# EAGLE design ciot (EAGLE 6.6.0)

## Sheet 1 of 2
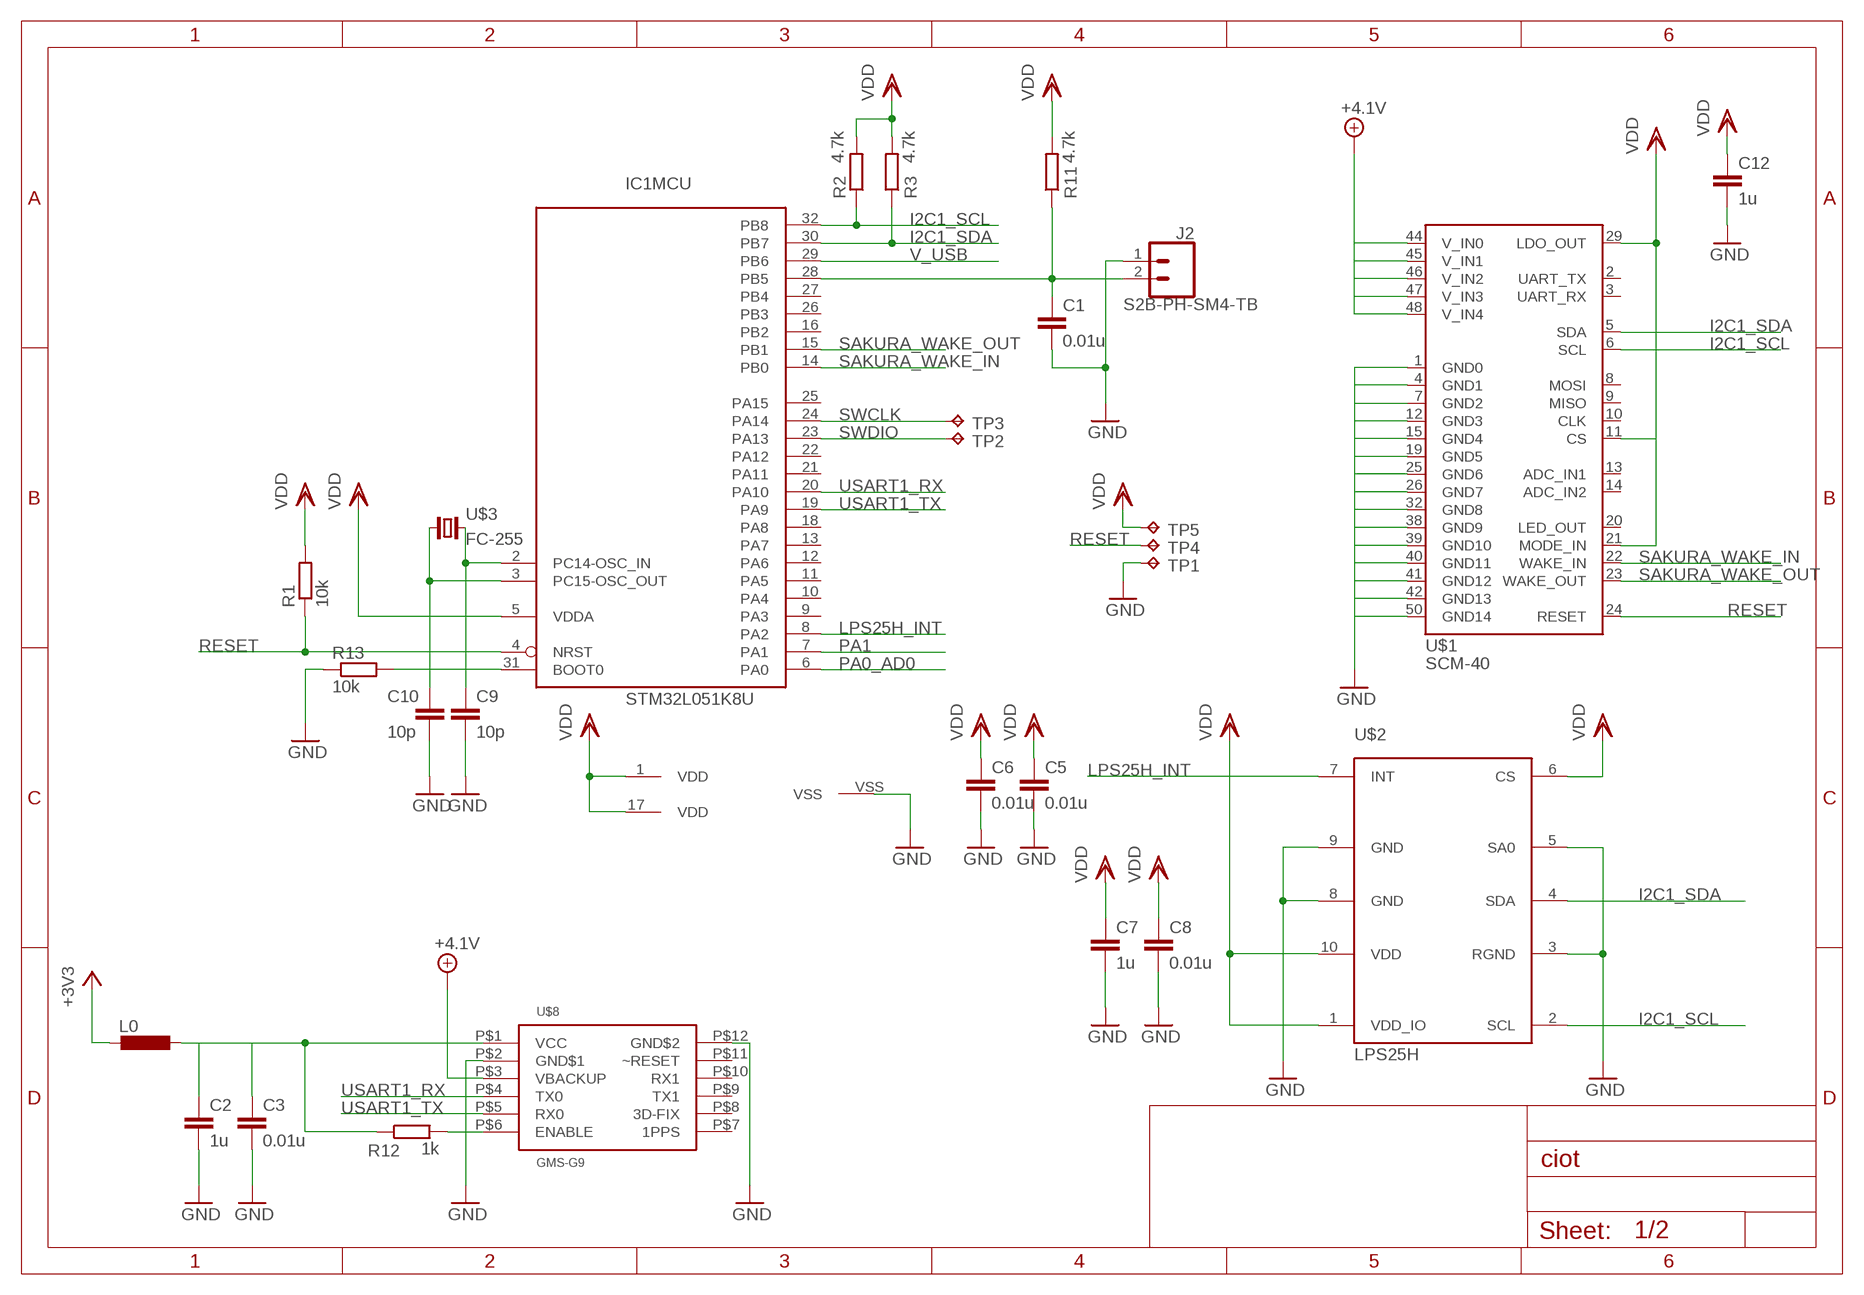
[diagram p0: schematic, sheet 1]

### Parts
C1  0.01u  C-EUC0603K  [C0603K]
C2  1u  C-EUC0603K  [C0603K]
C3  0.01u  C-EUC0603K  [C0603K]
C5  0.01u  C-EUC0603K  [C0603K]
C6  0.01u  C-EUC0603K  [C0603K]
C7  1u  C-EUC0603K  [C0603K]
C8  0.01u  C-EUC0603K  [C0603K]
C9  10p  C-EUC0603K  [C0603K]
C10  10p  C-EUC0603K  [C0603K]
C12  1u  C-EUC0603K  [C0603K]
IC1  STM32L051K8U  [UFQFPN32]
J2  S2B-PH-SM4-TB  CONN_02-JST-2MM-SMT  [JST-2-SMD]
L0  L-EUL2012C  [L2012C]
R1  10k  R-EU_R0603  [R0603]
R2  4.7k  R-EU_R0603  [R0603]
R3  4.7k  R-EU_R0603  [R0603]
R11  4.7k  R-EU_R0603  [R0603]
R12  1k  R-EU_R0603  [R0603]
R13  10k  R-EU_R0603  [R0603]
TP1  TPB1,27  [B1,27]
TP2  TPB1,27  [B1,27]
TP3  TPB1,27  [B1,27]
TP4  TPB1,27  [B1,27]
TP5  TPB1,27  [B1,27]
U$1  SCM-40  [SCM-DF40-50DS]
U$2  LPS25H  [LPS25H]
U$3  FC-255  [FC-255]
U$8  GMS-G9  [GMS-G9]

### Nets
+3V3: L0.2 ; also sheet 2
+4.1V: U$1.44(V_IN0) U$1.45(V_IN1) U$1.46(V_IN2) U$1.47(V_IN3) U$1.48(V_IN4) U$8.P$3(VBACKUP) ; also sheet 2
GND: C1.2 C2.2 C3.2 C5.2 C6.2 C7.2 C8.2 C9.2 C10.2 C12.2 IC1.VSS(PWR:VSS) J2.1 R13.1 TP1.TP U$1.1(GND0) U$1.4(GND1) U$1.7(GND2) U$1.12(GND3) U$1.15(GND4) U$1.19(GND5) U$1.25(GND6) U$1.26(GND7) U$1.32(GND8) U$1.38(GND9) U$1.39(GND10) U$1.40(GND11) U$1.41(GND12) U$1.42(GND13) U$1.50(GND14) U$2.3(RGND) U$2.5(SA0) U$2.8(GND) U$2.9(GND) U$8.P$2(GND$1) U$8.P$12(GND$2) ; also sheet 2
I2C1_SCL: IC1.32(MCU:PB8) R2.1 U$1.6(SCL) U$2.2(SCL)
I2C1_SDA: IC1.30(MCU:PB7) R3.1 U$1.5(SDA) U$2.4(SDA)
LPS25H_INT: IC1.8(MCU:PA2) U$2.7(INT)
N$1: IC1.31(MCU:BOOT0) R13.2
N$2: C2.1 C3.1 L0.1 R12.1 U$8.P$1(VCC)
N$3: C1.1 IC1.28(MCU:PB5) J2.2 R11.1
N$4: C10.1 IC1.3(MCU:PC15-OSC_OUT) U$3.1
N$5: C9.1 IC1.2(MCU:PC14-OSC_IN) U$3.2
N$25: R12.2 U$8.P$6(ENABLE)
PA0_AD0: IC1.6(MCU:PA0) ; also sheet 2
PA1: IC1.7(MCU:PA1) ; also sheet 2
RESET: IC1.4(MCU:NRST) R1.1 TP4.TP U$1.24(RESET)
SAKURA_WAKE_IN: IC1.14(MCU:PB0) U$1.22(WAKE_IN)
SAKURA_WAKE_OUT: IC1.15(MCU:PB1) U$1.23(WAKE_OUT)
SWCLK: IC1.24(MCU:PA14) TP3.TP
SWDIO: IC1.23(MCU:PA13) TP2.TP
USART1_RX: IC1.20(MCU:PA10) U$8.P$4(TX0)
USART1_TX: IC1.19(MCU:PA9) U$8.P$5(RX0)
V_USB: IC1.29(MCU:PB6) ; also sheet 2
VDD: C5.1 C6.1 C7.1 C8.1 C12.1 IC1.1(PWR:VDD) IC1.5(MCU:VDDA) IC1.17(PWR:VDD) R1.2 R2.2 R3.2 R11.2 TP5.TP U$1.11(CS) U$1.21(MODE_IN) U$1.29(LDO_OUT) U$2.1(VDD_IO) U$2.6(CS) U$2.10(VDD)
Unconnected: IC1.9(MCU:PA3) IC1.10(MCU:PA4) IC1.11(MCU:PA5) IC1.12(MCU:PA6) IC1.13(MCU:PA7) IC1.16(MCU:PB2) IC1.18(MCU:PA8) IC1.21(MCU:PA11) IC1.22(MCU:PA12) IC1.25(MCU:PA15) IC1.26(MCU:PB3) IC1.27(MCU:PB4) U$1.2(UART_TX) U$1.3(UART_RX) U$1.8(MOSI) U$1.9(MISO) U$1.10(CLK) U$1.13(ADC_IN1) U$1.14(ADC_IN2) U$1.20(LED_OUT) U$8.P$7(1PPS) U$8.P$8(3D-FIX) U$8.P$9(TX1) U$8.P$10(RX1) U$8.P$11(~RESET)

### Notes on the sheet
- LPS25H

## Sheet 2 of 2
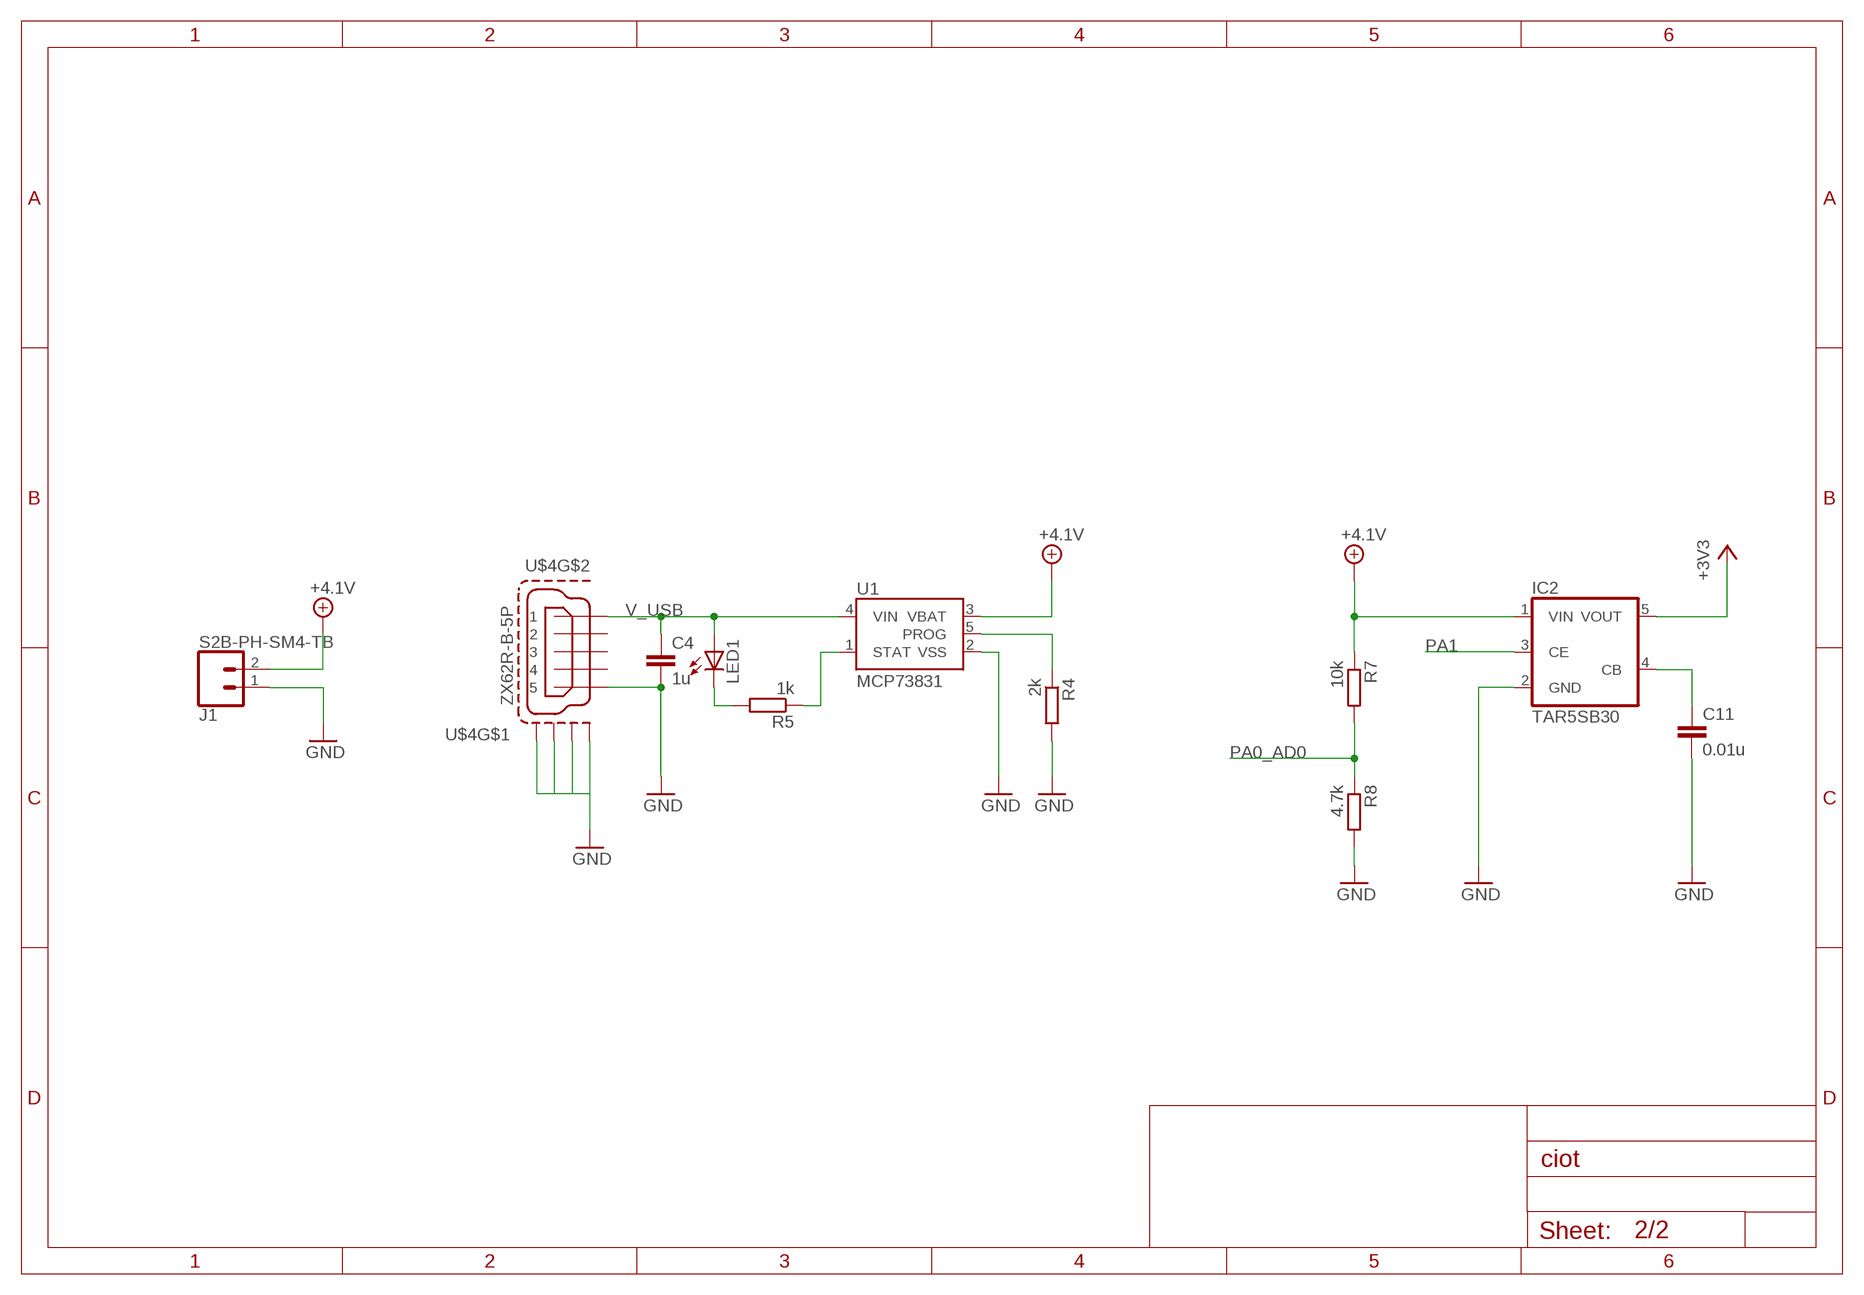
[diagram p1: schematic, sheet 2]

### Parts
C4  1u  C-EUC0603K  [C0603K]
C11  0.01u  C-EUC0603K  [C0603K]
IC2  TAR5SB30  TS520530  [SOT25]
J1  S2B-PH-SM4-TB  CONN_02-JST-2MM-SMT  [JST-2-SMD]
LED1  LEDCHIPLED_0603  [CHIPLED_0603]
R4  2k  R-EU_R0603  [R0603]
R5  1k  R-EU_R0603  [R0603]
R7  10k  R-EU_R0603  [R0603]
R8  4.7k  R-EU_R0603  [R0603]
U1  MCP73831  [SOT23-5]
U$4  ZX62R-B-5P  MICRO-USB-SHIELD-ZX62R-B-5P  [ZX62R-B-5P]

### Nets
+3V3: IC2.5(VOUT) ; also sheet 1
+4.1V: IC2.1(VIN) J1.2 R7.1 U1.3(VBAT) ; also sheet 1
GND: C4.2 C11.2 IC2.2(GND) J1.1 R4.2 R8.2 U1.2(VSS) U$4.5 U$4.M1(S1) U$4.M2(S2) U$4.M3(S3) U$4.M4(S4) ; also sheet 1
N$6: C11.1 IC2.4(CB)
N$8: LED1.C R5.2
N$9: R5.1 U1.1(STAT)
N$10: R4.1 U1.5(PROG)
PA0_AD0: R7.2 R8.1 ; also sheet 1
PA1: IC2.3(CE) ; also sheet 1
V_USB: C4.1 LED1.A U1.4(VIN) U$4.1 ; also sheet 1
Unconnected: U$4.2 U$4.3 U$4.4

## Library data of the parts
C1-C12 = resistor:C-EU: CAPACITOR, European symbol
IC1 = micro-stm_v3:STM32L051K*U: ARM 32-bit Cortex™-M0+ CPU 32 MHz maximum frequency 32 to 64 Kbytes of Flash memory 2 kbyte of Data EEPROM 8 kbytes of SRAM 27 GPIOs 1.8 to 3.6 V application supply
IC2 = v-reg:TS5205: 150mA Low Noise LDO Voltage Regulator with Enable TSC [Taiwan Semiconductor Company, Ltd] Source: http://www.taiwansemi.com .. 5205_0409c.pdf
J1 J2 = SparkFun-Connectors:CONN_02: Multi connection point. Often used as Generic Header-pin footprint for 0.1 inch spaced/style header connections On any of the 0.1 inch spaced packages, you can populate with these: Break Away Headers - Straight <https://www.sparkfun.com/products/116> (PRT-00116) Break Away Male Headers - Right Angle <https://www.sparkfun.com/products/553> (PRT-00553) Female Headers <https://www.sparkfun.com/products/115> (PRT-00115) Break Away Headers - Machine Pin <https://www.sparkfun.com/products/117> (PRT-00117) Break Away Female Headers - Swiss Machine Pin <https://www.sparkfun.com/products/743> (PRT-00743) For SCREWTERMINALS and SPRING TERMINALS visit here: Screw Terimnals on SparkFun.com <https://www.sparkfun.com/search/results?term=Screw+Terminals> (5mm/3.5mm/2.54mm spacing) This device is also useful as a general connection point to wire up your design to another part of your project. Our various solder wires solder well into these plated through hole pads. Hook-Up Wire - Assortment (Stranded, 22 AWG) <https://www.sparkfun.com/products/11375> (PRT-11375) Hook-Up Wire - Assortment (Solid Core, 22 AWG) <https://www.sparkfun.com/products/11367> (PRT-11367) View the entire wire category on our website here <https://www.sparkfun.com/categories/141> Special notes: Molex polarized connector foot print use with: PRT-08233 with associated crimp pins and housings. 2.54_SCREWTERM for use with PRT-10571. 3.5mm Screw Terminal footprints for PRT-08084 5mm Screw Terminal footprints for use with PRT-08432; PROD_ID: CONN-11443
L0 = resistor:L-EU: INDUCTOR, European symbol
LED1 = led:LED: LED OSRAM: - CHIPLED LG R971, LG N971, LY N971, LG Q971, LY Q971, LO R971, LY R971 LH N974, LH R974 LS Q976, LO Q976, LY Q976 LO Q996 - Hyper CHIPLED LW Q18S LB Q993, LB Q99A, LB R99A - SideLED LS A670, LO A670, LY A670, LG A670, LP A670 LB A673, LV A673, LT A673, LW A673 LH A674 LY A675 LS A676, LA A676, LO A676, LY A676, LW A676 LS A679, LY A679, LG A679 - Hyper Micro SIDELED® LS Y876, LA Y876, LO Y876, LY Y876 LT Y87S - SmartLED LW L88C, LW L88S LB L89C, LB L89S, LG L890 LS L89K, LO L89K, LY L89K LS L896, LA L896, LO L896, LY L896 - TOPLED LS T670, LO T670, LY T670, LG T670, LP T670 LSG T670, LSP T670, LSY T670, LOP T670, LYG T670 LG T671, LOG T671, LSG T671 LB T673, LV T673, LT T673, LW T673 LH T674 LS T676, LA T676, LO T676, LY T676, LB T676, LH T676, LSB T676, LW T676 LB T67C, LV T67C, LT T67C, LS T67K, LO T67K, LY T67K, LW E67C LS E67B, LA E67B, LO E67B, LY E67B, LB E67C, LV E67C, LT E67C LW T67C LS T679, LY T679, LG T679 LS T770, LO T770, LY T770, LG T770, LP T770 LB T773, LV T773, LT T773, LW T773 LH T774 LS E675, LA E675, LY E675, LS T675 LS T776, LA T776, LO T776, LY T776, LB T776 LHGB T686 LT T68C, LB T68C - Hyper Mini TOPLED® LB M676 - Mini TOPLED Santana® LG M470 LS M47K, LO M47K, LY M47K Source: http://www.osram.convergy.de LUXEON: - LUMILED® LXK2-PW12-R00, LXK2-PW12-S00, LXK2-PW14-U00, LXK2-PW14-V00 LXK2-PM12-R00, LXK2-PM12-S00, LXK2-PM14-U00 LXK2-PE12-Q00, LXK2-PE12-R00, LXK2-PE12-S00, LXK2-PE14-T00, LXK2-PE14-U00 LXK2-PB12-K00, LXK2-PB12-L00, LXK2-PB12-M00, LXK2-PB14-N00, LXK2-PB14-P00, LXK2-PB14-Q00 LXK2-PR12-L00, LXK2-PR12-M00, LXK2-PR14-Q00, LXK2-PR14-R00 LXK2-PD12-Q00, LXK2-PD12-R00, LXK2-PD12-S00 LXK2-PH12-R00, LXK2-PH12-S00 LXK2-PL12-P00, LXK2-PL12-Q00, LXK2-PL12-R00 Source: www.luxeon.com KINGBRIGHT: KA-3528ASYC Source: www.kingbright.com
R1-R5 R7 R8 R11-R13 = resistor:R-EU_: RESISTOR, European symbol
TP1-TP5 = testpad:TP: Test pad
U1 = SparkFun-PowerIC:MCP73831: Miniature single cell, fully integrated Li-Ion, Li-polymer charge management controller http://ww1.microchip.com/downloads/en/DeviceDoc/21984a.pdf IC-09995; PROD_ID: IC-09995
U$1 = sakuraio:SCM-40
U$2 = chips:LPS25H: ST-Micro Piezoresistive pressure sensor; DIGIKEY: 497-15070-1-ND
U$3 = crystal:FC-255
U$4 = con-hirose:MICRO-USB-SHIELD-: Hirose Micro USB Connector ZX62R-B-5P: Micro B, reverse (top mount) shell SMT Supplier: DigiKey H11574CT-ND Source: http://www.hirose.co.jp/cataloge_hp/e24200011.pdf
U$8 = gms-g9:GMS-G9

## Board
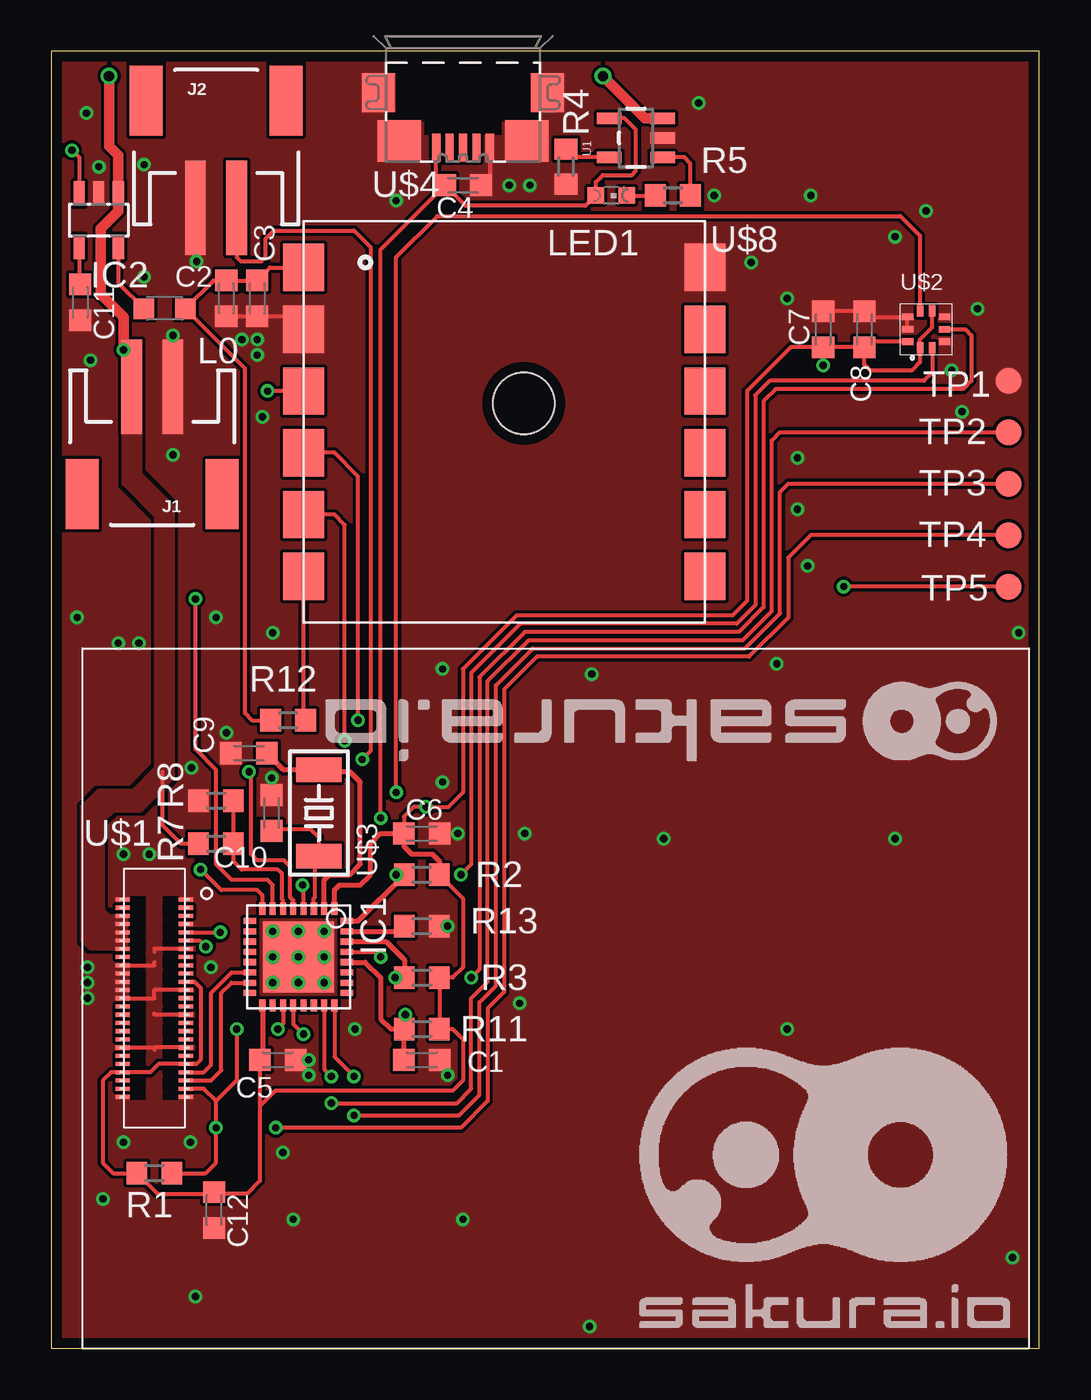
[diagram p2: board, top side]
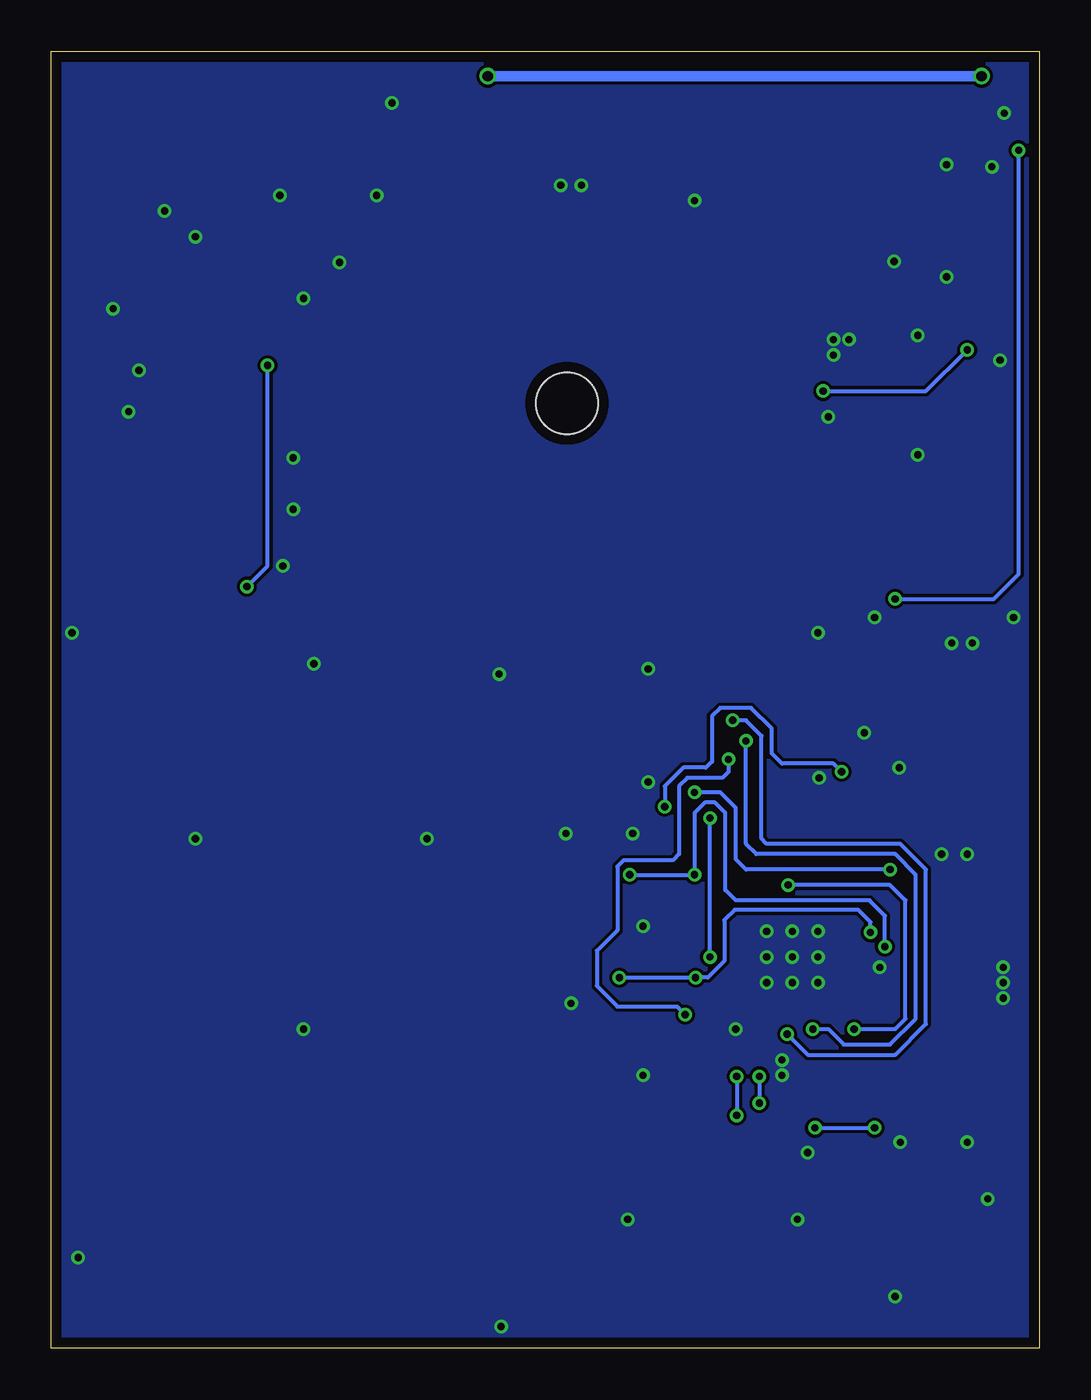
[diagram p3: board, bottom side, seen from below]

Size 48 x 63 mm. Coordinates in mm from the lower left corner, seen from the top.
Outline: 0,0 48,0 48,63 0,63 0,0
Copper layers (1*16): Top 0.035mm / dielectric 1.6mm / Bottom 0.035mm
Design rules "Elecrow_2-layer_PCB_eagle_rule": minimum track width 6mil, minimum drill 12mil, track to track 6mil, track to pad 6mil, pad to pad 6mil, via to via 8mil, smd to smd 0mil, copper to edge 20mil, drill to drill 10mil, minimum pad ring 6mil, minimum via ring 6mil, stop-mask expansion 0mil, vias tented up to drill 100mil, thermal gap 10mil

### Footprints (pad centres in the part's own frame; a part is rotated, then mirrored left to right if it is on the bottom)
C0603K = smd 1.05 x 1.08: 1 -0.875,0; 2 0.875,0
UFQFPN32 = smd 0.6 x 0.3: 1 -2.35,1.75; 2 -2.35,1.25; 3 -2.35,0.75; 4 -2.35,0.25; 5 -2.35,-0.25; 6 -2.35,-0.75; 7 -2.35,-1.25; 8 -2.35,-1.75; 17 2.35,-1.75; 18 2.35,-1.25; 19 2.35,-0.75; 20 2.35,-0.25; 21 2.35,0.25; 22 2.35,0.75; 23 2.35,1.25; 24 2.35,1.75 | smd 0.3 x 0.6: 9 -1.75,-2.35; 10 -1.25,-2.35; 11 -0.75,-2.35; 12 -0.25,-2.35; 13 0.25,-2.35; 14 0.75,-2.35; 15 1.25,-2.35; 16 1.75,-2.35; 25 1.75,2.35; 26 1.25,2.35; 27 0.75,2.35; 28 0.25,2.35; 29 -0.25,2.35; 30 -0.75,2.35; 31 -1.25,2.35; 32 -1.75,2.35 | smd 3.45 x 3.45: VSS 0,0
SOT25 = smd 0.55 x 1.2: 1 -0.95,-1.3; 2 0,-1.3; 3 0.95,-1.3; 4 0.95,1.3; 5 -0.95,1.3
JST-2-SMD = smd 1 x 4.6: 1 -1,-3.7; 2 1,-3.7 | smd 1.6 x 3.4: NC1 -3.4,1.5; NC2 3.4,1.5
L2012C = smd 1 x 1: 1 -1,0; 2 1,0
CHIPLED_0603 = smd 0.8 x 0.8: A 0,-0.75; C 0,0.75
R0603 = smd 1 x 1.1: 1 -0.85,0; 2 0.85,0
B1,27 = smd 1.27 x 1.27: TP 0,0
SOT23-5 = smd 0.55 x 1.2: 1 -0.95,-1.3; 2 0,-1.3; 3 0.95,-1.3; 4 0.95,1.3; 5 -0.95,1.3
SCM-DF40-50DS = smd 0.7 x 0.2: 1 -1.54,-4.8; 2 -1.54,-4.4; 3 -1.54,-4; 4 -1.54,-3.6; 5 -1.54,-3.2; 6 -1.54,-2.8; 7 -1.54,-2.4; 8 -1.54,-2; 9 -1.54,-1.6; 10 -1.54,-1.2; 11 -1.54,-0.8; 12 -1.54,-0.4; 13 -1.54,0; 14 -1.54,0.4; 15 -1.54,0.8; 16 -1.54,1.2; 17 -1.54,1.6; 18 -1.54,2; 19 -1.54,2.4; 20 -1.54,2.8; 21 -1.54,3.2; 22 -1.54,3.6; 23 -1.54,4; 24 -1.54,4.4; 25 -1.54,4.8; 26 1.54,4.8; 27 1.54,4.4; 28 1.54,4; 29 1.54,3.6; 30 1.54,3.2; 31 1.54,2.8; 32 1.54,2.4; 33 1.54,2; 34 1.54,1.6; 35 1.54,1.2; 36 1.54,0.8; 37 1.54,0.4; 38 1.54,0; 39 1.54,-0.4; 40 1.54,-0.8; 41 1.54,-1.2; 42 1.54,-1.6; 43 1.54,-2; 44 1.54,-2.4; 45 1.54,-2.8; 46 1.54,-3.2; 47 1.54,-3.6; 48 1.54,-4; 49 1.54,-4.4; 50 1.54,-4.8
LPS25H = smd 0.32 x 0.55: 1 -0.3,-0.9; 2 0.3,-0.9; 6 0.3,0.9; 7 -0.3,0.9 | smd 0.55 x 0.32: 3 0.9,-0.6; 4 0.9,0; 5 0.9,0.6; 8 -0.9,0.6; 9 -0.9,0; 10 -0.9,-0.6
FC-255 = smd 1.2 x 2.2: 1 -2.1,0; 2 2.1,0
ZX62R-B-5P = smd 1.35 x 0.4: 1 2.675,-1.3; 2 2.675,-0.65; 3 2.675,0; 4 2.675,0.65; 5 2.675,1.3 | smd 1.9 x 1.6: M1 0,-4.1; M2 0,4.1 | smd 2 x 2.1: M3 2.35,3.1; M4 2.35,-3.1
GMS-G9 = smd 2 x 2.3: P$1 -9.75,7.5; P$2 -9.75,4.5; P$3 -9.75,1.5; P$4 -9.75,-1.5; P$5 -9.75,-4.5; P$6 -9.75,-7.5; P$7 9.75,-7.5; P$8 9.75,-4.5; P$9 9.75,-1.5; P$10 9.75,1.5; P$11 9.75,4.5; P$12 9.75,7.5 | hole 3: 0.95,0.9

### Placement (x,y rotation side)
C1  18,14 0 top
C2  8.5,51 270 top
C3  10,51 270 top
C4  20,56.5 0 top
C5  11,14 0 top
C6  18,25 0 top
C7  37.5,49.5 90 top
C8  39.5,49.5 90 top
C9  9.6,28.9 180 top
C10  10.7,26 90 top
C11  1.4,50.8 270 top
C12  7.9,6.7 270 top
IC1  12,19 270 top
IC2  2.3,54.8 180 top
J1  4.9,43 180 top
J2  8,59.1 0 top
L0  5.5,50.5 180 top
LED1  27.2,56 270 top
R1  5,8.5 180 top
R2  18,23 0 top
R3  18,18 0 top
R4  25,57.4 270 top
R5  30.2,56 180 top
R7  8,24.5 0 top
R8  8,26.6 180 top
R11  18,15.5 0 top
R12  11.5,30.5 0 top
R13  18,20.5 180 top
TP1  46.5,47 90 top
TP2  46.5,44.5 90 top
TP3  46.5,42 90 top
TP4  46.5,39.5 90 top
TP5  46.5,37 0 top
U1  28.4,58.8 90 top
U$1  5,17 180 top
U$2  42.5,49.5 0 top
U$3  13,26 90 top
U$4  20,61 270 top
U$5  [LOGO-SAKURAIO-3]  28.4,0.8 0 top
U$8  22,45 0 top

### Tracks (layer width: path | path; a pad name or v marks a point on that pad's centre or on a via)
+3V3
  Top 0.2: IC2.5 3.25,51.75 L0.2
+4.1V  (via drill 0.35, 0.5)
  Top 0.2: U$8.P$3 v10.5,46.5 | R7.1 6.3,24.5 5.4,25.4 5.4,28
  Top 0.5: v3.5,48.5 3.5,50.1 2.4,51.2 2.4,54.4 3.25,55.25 IC2.1 3.25,57.95 2.8,58.4 v2.8,61.8 | U1.3 28.85,59.75 v26.8,61.8
  Bottom 0.2: v10.5,46.5 5.5,46.5 v3.5,48.5
  Bottom 0.5: v26.8,61.8 v2.8,61.8
  pour Top (isolate 0.1, no thermals): 2.8,21 3.7,21 3.7,19.4 1.9,19.4 1.5,19.8 1.5,26.3 2.3,27.1 4,27.1 5.1,28.2 5.1,40.4 3.5,42 3.5,48.9 4.3,48.9 4.3,42.5 5.9,40.9 5.9,27.7 4.3,26.1 3,26.1 2.5,25.6 2.5,21.3
GND  (via drill 0.35)
  Top 0.2: U$8.P$2 11.62,50.12 C3.2 C2.2 | U$4.5 21.3,56.92 C4.2 | C7.2 C8.2 39.77,50.1 U$2.8 U$2.9 | U$1.12 5,17.4 5,17 U$1.38 | U$1.7 5,19.4 5,19.25 | U$1.42 5,18.6 5,18.75 | U$1.19 5,14.6 | U$1.15 5,16.2 5,16.25 | U$1.32 5,14.6 | 5,14.6 5,14.5
  other vias: 12.5,14 12.5,13.25 19.25,13.25 19.25,20.5 19.75,25 10.75,20.25 13.25,20.25 13.25,17.75 10.75,17.75 10.75,19 12,19 12,20.25 13.25,19 12,17.75 1.75,17 1.75,17.75 1.75,18.5 10.7,27.7 6.8,28.2 10,49 9.25,49 10.25,45.25 10,48.25 22.25,56.5 23.25,56.5 35.75,51 41,54 42.5,55.25 44.25,45.5 45,50.5 43.75,47.5 26.25,32.75 11.75,6.25 19,33 41,24.75 19,27.5 23,25 36.75,38 22.75,16.75 11.25,9.5 6.75,10 3.5,10 2.3,57.4 36.9,56 31.45,60.5 34,52.75 3.5,24 4.75,24 36.25,40.75 36.25,43.25 32.2,56 16.75,55.75 7.05,52.8 4.5,52.05 4.5,57.5 10.75,34.75 3.25,34.25 4.25,34.25 7.75,18.5 46.7,4.4 26.15,1.05 35.75,15.5 29.75,24.75 7,2.5 20,6.25 35.25,33.25 47,34.75 8,35.5 1.25,35.5 2.5,7.25 14.75,15.5 5.9,49.2 5.9,43.4 1.9,48 1.7,60 8.5,29.9
  pour Top (isolate 0.05, rank 2, no thermals): -2,65 50,65 50,-2 -2,-2
  pour Bottom: -5,68 53,68 53,-6 -5,-6
I2C1_SCL  (via drill 0.35)
  Top 0.2: U$1.6 7.2,19.8 v7.5,19.5 | 16.75,22.9 v16.75,23 R2.1 | U$2.2 42.8,47.4 42.4,47 34.9,47 34.2,46.3 34.2,36.1 33.3,35.2 22.8,35.2 20.4,32.8 20.4,23.5 v19.9,23
  Top 0.254: IC1.32 14.9,20.75 R2.1
  Bottom 0.2: v7.5,19.5 7.5,21 8.25,21.75 14.75,21.75 15.25,22.25 15.25,26 15.75,26.5 16.25,26.5 16.75,26 v16.75,23 v19.9,23
I2C1_SDA  (via drill 0.35)
  Top 0.2: U$2.4 44.4,49.5 44.7,49.2 44.7,47 44.3,46.6 35.2,46.6 34.6,46 34.6,36 33.4,34.8 23,34.8 20.8,32.6 20.8,18.4 v20.4,18 | U$1.5 v8.2,20.2 | v16.7,18 R3.1
  Top 0.254: IC1.30 16.25,19.75 17.15,18.85 R3.1
  Bottom 0.2: v8.2,20.2 8.2,20.7 8.8,21.3 14.8,21.3 15.3,20.8 15.3,18.8 16.1,18 v16.7,18 v20.4,18
LPS25H_INT  (via drill 0.35)
  Top 0.2: IC1.8 10.25,22 10,22.25 8.25,22.25 v7.25,23.25 | v16.75,27 16.75,53 18.75,55 41.25,55 42.2,54.05 U$2.7
  Bottom 0.2: v7.25,23.25 14.25,23.25 14.75,23.75 14.75,26.25 15.5,27 v16.75,27
N$1
  Top 0.254: IC1.31 16.9,20.25 R13.2
N$2
  Top 0.2: U$8.P$1 10.62,52.5 C3.1 C2.1 7.88,51.88 L0.1 9.4,47.6 9.4,30.85 9.75,30.5 R12.1
N$3  (via drill 0.35)
  Top 0.2: J2.2 9,53 9.2,52.8 10.2,52.8 10.4,53 10.4,53.9 10.8,54.3 14.7,54.3 15.5,53.5 15.5,29 v15.1,28.6 | v17.2,16.2 17.2,15.55 R11.1
  Top 0.254: IC1.28 15.25,18.75 16,18 16,16 16.5,15.5 R11.1 17.12,15.47 C1.1
  Bottom 0.2: v15.1,28.6 15.1,28 15.4,27.7 17.1,27.7 17.5,27.3 17.5,24 17.8,23.7 20.2,23.7 20.5,23.4 20.5,20.3 21.5,19.3 21.5,17.6 20.5,16.6 17.6,16.6 v17.2,16.2
N$4
  Top 0.2: C10.1 10.57,25.2 12.6,25.2 13,24.8 U$3.1 12.8,23.7 12.8,21.9 12.75,21.85 IC1.3
  Top 0.254: 12.75,23.65 U$3.1
N$5
  Top 0.254: IC1.2 13.25,22.75 13.5,23 14.5,23 15,23.5 15,27.5 14.5,28 13.1,28 U$3.2 11.28,28.1 C9.1
N$6
  Top 0.2: IC2.4 1.35,51.73 C11.1
N$8
  Top 0.2: LED1.C R5.2
N$9
  Top 0.2: R5.1 31.05,57.55 30.75,57.85 U1.1
N$10
  Top 0.2: U1.5 25.4,57.85 R4.1
N$25
  Top 0.2: R12.2 12.25,30.6 U$8.P$6
PA0_AD0
  Top 0.2: R8.1 R7.2 8.85,23.65 9.25,23.25 11,23.25 11.2,23.05 11.2,21.8 11.25,21.75 IC1.6
PA1  (via drill 0.35)
  Top 0.2: IC1.7 10.75,22.5 10.5,22.75 8.75,22.75 8,23.5 8,28.1 7,29.1 v7,36.4 | v1,58.2 1.35,57.85 IC2.3
  Bottom 0.2: v7,36.4 2.2,36.4 1,37.6 v1,58.2
RESET  (via drill 0.35)
  Top 0.2: R1.1 7.5,8.5 8,9 v8,10.7 8,12 | 8,12 7.4,12.6 U$1.24 | IC1.4 12.25,22.45 v12.2,22.5 | v9,15.5 9,13 8,12 | TP4.TP 36.9,39.5 35.8,38.4 35.8,35.5 33.9,33.6 23.6,33.6 22,32 22,17.3 21.2,16.5 21.2,12 19.9,10.7 v10.9,10.7
  Bottom 0.2: v9,15.5 7,15.5 6.5,16 6.5,21.75 7.25,22.5 v12.2,22.5 | v10.9,10.7 v8,10.7
SAKURA_WAKE_IN
  Top 0.2: U$1.22 7.4,13.4 7.75,13.75 7.75,17.25 8.75,18.25 IC1.14
SAKURA_WAKE_OUT
  Top 0.2: U$1.23 7.75,13 8.25,13.5 8.25,17.25 8.75,17.75 IC1.15
SWCLK  (via drill 0.35)
  Top 0.2: IC1.24 13.75,14.15 v14.7,13.2 | v14.7,11.3 19.8,11.3 20.8,12.3 20.8,16.8 21.6,17.6 21.6,32.2 23.4,34 33.7,34 35.4,35.7 35.4,41.6 35.8,42 TP3.TP
  Bottom 0.2: v14.7,13.2 v14.7,11.3
SWDIO  (via drill 0.35)
  Top 0.2: IC1.23 13.25,13.55 v13.6,13.2 | v13.6,11.9 19.7,11.9 20.4,12.6 20.4,17 21.2,17.8 21.2,32.4 23.2,34.4 33.6,34.4 35,35.8 35,44.1 35.4,44.5 TP2.TP
  Bottom 0.2: v13.6,13.2 v13.6,11.9
USART1_RX  (via drill 0.35)
  Top 0.2: IC1.20 11.75,15.75 v12.25,15.25 | v14.9,30.5 14.9,42.35 13.75,43.5 U$8.P$4
  Bottom 0.2: v12.25,15.25 11.25,14.25 7,14.25 5.5,15.75 5.5,23.25 6.75,24.5 13.25,24.5 13.5,24.75 13.5,29.75 14.25,30.5 v14.9,30.5
USART1_TX  (via drill 0.35)
  Top 0.2: IC1.19 11.25,15.75 v11,15.5 | v14.25,29.5 14.25,40 13.75,40.5 U$8.P$5
  Bottom 0.2: v11,15.5 10.25,15.5 9.5,14.75 7.25,14.75 6,16 6,23 7,24 13.75,24 14.25,24.5 v14.25,29.5
V_USB  (via drill 0.35)
  Top 0.2: IC1.29 15.75,19.25 v16,19 | v16,25.75 16,53.38 C4.1 | C4.1 20.12,55.5 25.95,55.5 LED1.A 26.45,56.65 26.8,57 28.2,57 28.4,57.2 28.4,59.2 27.85,59.75 U1.4 | C4.1 18.7,56.92 U$4.1
  Bottom 0.2: v16,19 v16,25.75
VDD  (via drill 0.35)
  Top 0.2: C5.1 10.12,11.75 | 10.12,11.75 10.12,8.12 9.5,7.5 7.9,7.5 | U$1.11 6.95,17.8 7.25,17.5 7.25,14 7.05,13.8 U$1.21 5.2,13.8 4.8,13.4 U$1.29 2.9,13.4 2.5,13 2.5,9 3,8.5 R1.2 5.15,7.5 7.9,7.5 | R2.2 20,21.85 20,18.5 19.5,18 R3.2 R11.2 19.5,15.5 20,15 20,13 19.5,12.5 10.88,12.5 10.12,11.75 | C7.1 35.92,48.62 33.8,46.5 33.8,36.3 33.1,35.6 22.6,35.6 20,33 20,27 19.3,26.3 v18.2,26.3 17.6,26.3 17.12,25.82 C6.1 | U$2.10 39.77,48.9 C8.1 | C8.1 39.5,47.8 39.8,47.5 41.8,47.5 42.2,47.9 U$2.1 42.2,49 42.8,49.6 U$2.6 | C8.1 C7.1 | TP5.TP v38.5,37 | v37.5,47.75 C7.1 | IC1.5 11.75,21.75 11.6,21.9 11.6,23.4 11.3,23.7 10,23.7 9.7,24 9.7,27.9 v9.6,28 | 7.9,7.5 C12.1
  Top 0.254: IC1.1 13.75,22.25 14,22.5 15,22.5 15.5,23 15.5,24.5 16,25 C6.1 17.12,24.38 17.5,24 18.5,24 18.85,23.65 R2.2 | IC1.17 10.25,14.12 C5.1
  Bottom 0.2: v38.5,37 37.5,38 v37.5,47.75 | v9.6,28 10,28.4 12.5,28.4 13,28.9 13,30.1 14,31.1 15.5,31.1 15.9,30.7 15.9,28.5 16.2,28.2 17.3,28.2 18.2,27.3 v18.2,26.3